# Altium project PCB_Project.PrjPcb
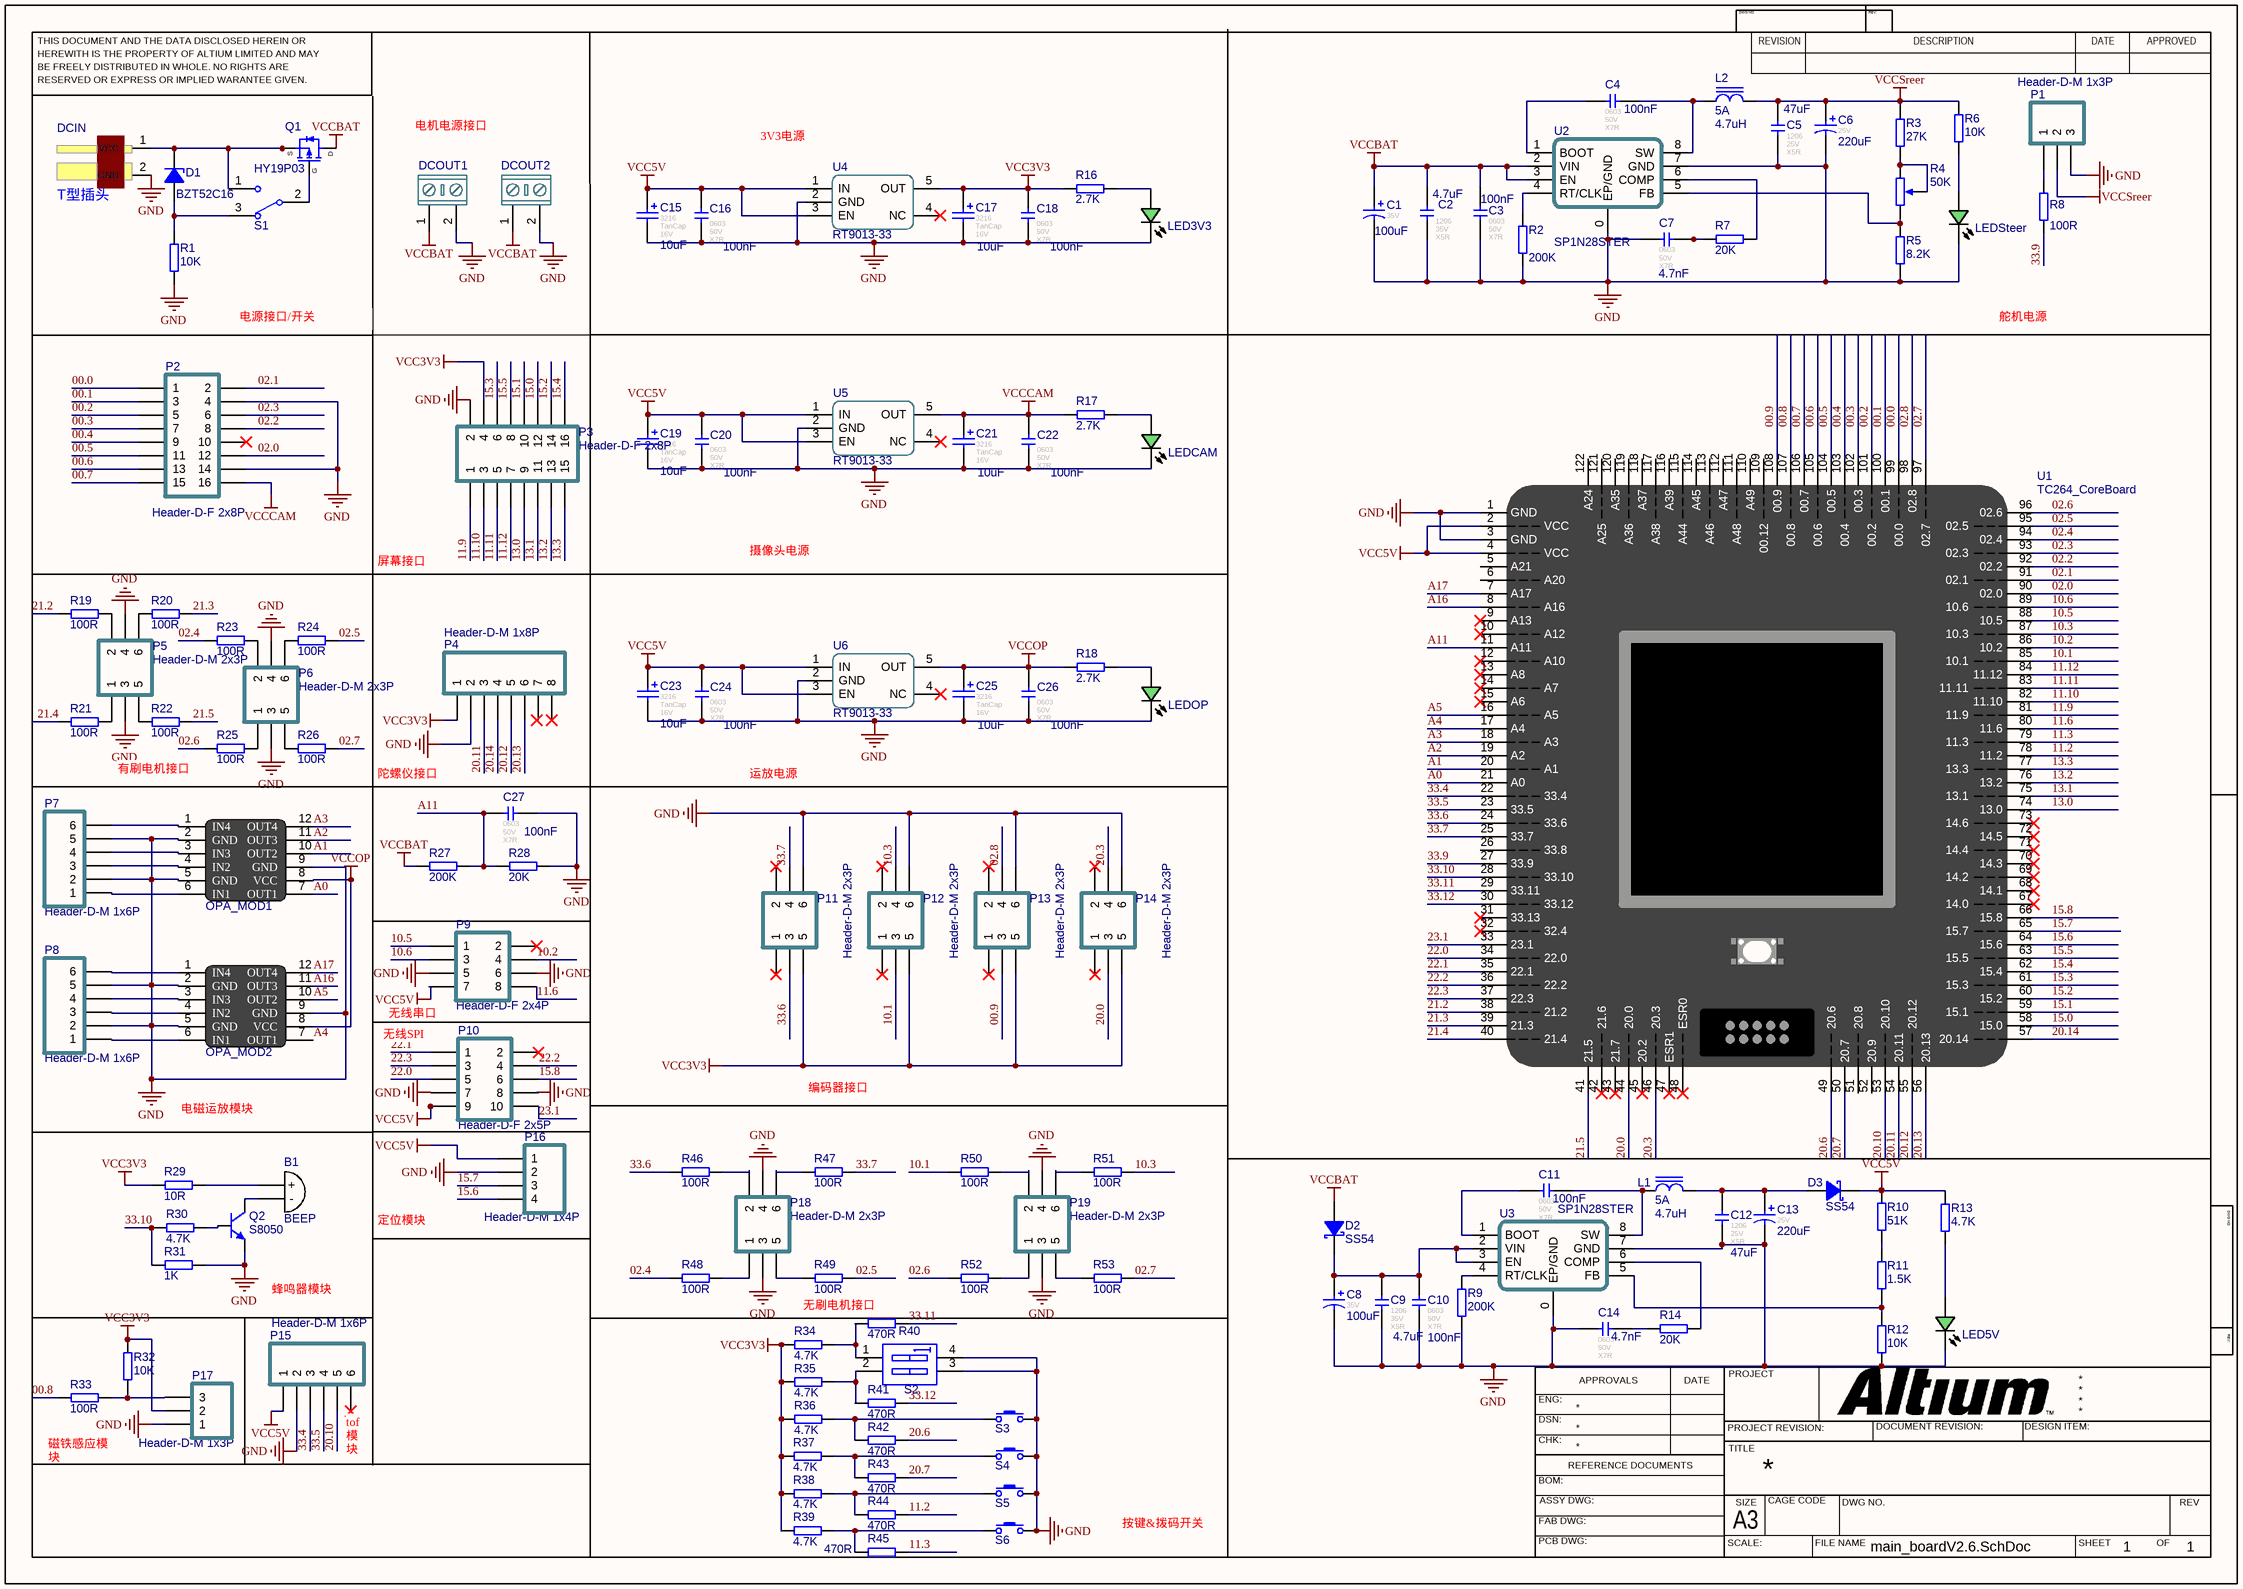
[diagram p0: main_boardV2.6.SchDoc]
1 sheet, 128 parts. Net scope: global (net labels, ports and power ports of the same name join across sheets).
Board file: PCB1.PcbDoc

## Sheet main_boardV2.6.SchDoc
size 420 x 297 mm; SheetNumber: 1; SheetTotal: 1

### Parts
B1  BEEP  [BEEP 9x5.5mm]
C1  value 100uF  Voltage: 35V  [CAP-E-S 6.3]  (hidden comment: 100uF 35V 铝电解)
C2  value 4.7uF  FootPrint: 1206  Voltage: 35V  Type: X5R  [CAPC3216[1206]S]  (hidden comment: 4.7uF 35V X5R)
C3  value 100nF  FootPrint: 0603  Voltage: 50V  Type: X7R  [CAPC1608[0603]S-N]  (hidden comment: 100nF 50V X7R)
C4  value 100nF  FootPrint: 0603  Voltage: 50V  Type: X7R  [CAPC1608[0603]S-N]  (hidden comment: 100nF 50V X7R)
C5  value 47uF  FootPrint: 1206  Voltage: 25V  Type: X5R  [CAPC3216[1206]S]  (hidden comment: 47uF 25V X5R)
C6  value 220uF  Voltage: 25V  [CAP-E-S 6.3]  (hidden comment: 220uF 25V 铝电解)
C7  value 4.7nF  FootPrint: 0603  Voltage: 50V  Type: X7R  [CAPC1608[0603]S-N]  (hidden comment: 4.7nF 50V X7R)
C8  value 100uF  Voltage: 35V  [CAP-E-S 6.3]  (hidden comment: 100uF 35V 铝电解)
C9  value 4.7uF  FootPrint: 1206  Voltage: 35V  Type: X5R  [CAPC3216[1206]S]  (hidden comment: 4.7uF 35V X5R)
C10  value 100nF  FootPrint: 0603  Voltage: 50V  Type: X7R  [CAPC1608[0603]S-N]  (hidden comment: 100nF 50V X7R)
C11  value 100nF  FootPrint: 0603  Voltage: 50V  Type: X7R  [CAPC1608[0603]S-N]  (hidden comment: 100nF 50V X7R)
C12  value 47uF  FootPrint: 1206  Voltage: 25V  Type: X5R  [CAPC3216[1206]S]  (hidden comment: 47uF 25V X5R)
C13  value 220uF  Voltage: 25V  [CAP-E-S 6.3]  (hidden comment: 220uF 25V 铝电解)
C14  value 4.7nF  FootPrint: 0603  Voltage: 50V  Type: X7R  [CAPC1608[0603]S-N]  (hidden comment: 4.7nF 50V X7R)
C15  value 10uF  FootPrint: 3216  Type: TanCap  Voltage: 16V  [CAP-T-S 3216]  (hidden comment: 10uF 16V 钽电容)
C16  value 100nF  FootPrint: 0603  Voltage: 50V  Type: X7R  [CAPC1608[0603]S-N]  (hidden comment: 100nF 50V X7R)
C17  value 10uF  FootPrint: 3216  Type: TanCap  Voltage: 16V  [CAP-T-S 3216]  (hidden comment: 10uF 16V 钽电容)
C18  value 100nF  FootPrint: 0603  Voltage: 50V  Type: X7R  [CAPC1608[0603]S-N]  (hidden comment: 100nF 50V X7R)
C19  value 10uF  FootPrint: 3216  Type: TanCap  Voltage: 16V  [CAP-T-S 3216]  (hidden comment: 10uF 16V 钽电容)
C20  value 100nF  FootPrint: 0603  Voltage: 50V  Type: X7R  [CAPC1608[0603]S-N]  (hidden comment: 100nF 50V X7R)
C21  value 10uF  FootPrint: 3216  Type: TanCap  Voltage: 16V  [CAP-T-S 3216]  (hidden comment: 10uF 16V 钽电容)
C22  value 100nF  FootPrint: 0603  Voltage: 50V  Type: X7R  [CAPC1608[0603]S-N]  (hidden comment: 100nF 50V X7R)
C23  value 10uF  FootPrint: 3216  Type: TanCap  Voltage: 16V  [CAP-T-S 3216]  (hidden comment: 10uF 16V 钽电容)
C24  value 100nF  FootPrint: 0603  Voltage: 50V  Type: X7R  [CAPC1608[0603]S-N]  (hidden comment: 100nF 50V X7R)
C25  value 10uF  FootPrint: 3216  Type: TanCap  Voltage: 16V  [CAP-T-S 3216]  (hidden comment: 10uF 16V 钽电容)
C26  value 100nF  FootPrint: 0603  Voltage: 50V  Type: X7R  [CAPC1608[0603]S-N]  (hidden comment: 100nF 50V X7R)
C27  value 100nF  FootPrint: 0603  Voltage: 50V  Type: X7R  [CAPC1608[0603]S-N]  (hidden comment: 100nF 50V X7R)
D1  BZT52C16  [SOD-123-L]
D2  SS54  [SMA-L[DO-214AC]]
D3  SS54  [SMA-L[DO-214AC]]
DCIN  T型插头  [Wired T-Header ThroughHole]
DCOUT1  KF/WJ/DG 30x connecter  [KF/WJ/DG 301-2p-5.0mm]  (value not drawn)
DCOUT2  KF/WJ/DG 30x connecter  [KF/WJ/DG 301-2p-5.0mm]  (value not drawn)
L1  value 4.7uH  Imax: 5A  [0630 TPC 7*7*3]  (hidden comment: 4.7uH 5A)
L2  value 4.7uH  Imax: 5A  [0630 TPC 7*7*3]  (hidden comment: 4.7uH 5A)
LED3V3  翠绿贴片LED  [LEDC1608(0603)-L]  (value not drawn)
LED5V  翠绿贴片LED  [LEDC1608(0603)-L]  (value not drawn)
LEDCAM  翠绿贴片LED  [LEDC1608(0603)-L]  (value not drawn)
LEDOP  翠绿贴片LED  [LEDC1608(0603)-L]  (value not drawn)
LEDSteer  翠绿贴片LED  [LEDC1608(0603)-L]  (value not drawn)
OPA_MOD1  OPA_MOD  [SEEKFREE_4CHANEL_OPAMOD]  (value not drawn)
OPA_MOD2  OPA_MOD  [SEEKFREE_4CHANEL_OPAMOD]  (value not drawn)
P1  Header-D-M 1x3P  [HDR1X3-M]
P2  Header-D-F 2x8P  [HDR2X8-F]
P3  Header-D-F 2x8P  [HDR2X8-F]
P4  Header-D-M 1x8P  [HDR1X8-M]
P5  Header-D-M 2x3P  [HDR2X3-M]
P6  Header-D-M 2x3P  [HDR2X3-M]
P7  Header-D-M 1x6P  [HDR1X6-M]
P8  Header-D-M 1x6P  [HDR1X6-M]
P9  Header-D-F 2x4P  [HDR2X4-F]
P10  Header-D-F 2x5P  [HDR2X5-F]
P11  Header-D-M 2x3P  [HDR2X3-M]
P12  Header-D-M 2x3P  [HDR2X3-M]
P13  Header-D-M 2x3P  [HDR2X3-M]
P14  Header-D-M 2x3P  [HDR2X3-M]
P15  Header-D-M 1x6P  [HDR1X6-M]
P16  Header-D-M 1x4P  [HDR1X4-M]
P17  Header-D-M 1x3P  [HDR1X3-M]
P18  Header-D-M 2x3P  [HDR2X3-M]
P19  Header-D-M 2x3P  [HDR2X3-M]
Q1  HY19P03  [TO-252AA]
Q2  S8050  [SOT-23]
R1  value 10K  [RESC1608[0603]S-N]  (hidden comment: 10K ±1%)
R2  value 200K  [RESC1608[0603]S-N]  (hidden comment: 200K ±1%)
R3  value 27K  [RESC1608[0603]S-N]  (hidden comment: 27K ±1%)
R4  50K  [RESPOT3296W]
R5  value 8.2K  [RESC1608[0603]S-N]  (hidden comment: 8.2K ±1%)
R6  value 10K  [RESC1608[0603]S-N]  (hidden comment: 10K ±1%)
R7  value 20K  [RESC1608[0603]S-N]  (hidden comment: 20K ±1%)
R8  value 100R  [RESC1608[0603]S-N]  (hidden comment: 100R ±1%)
R9  value 200K  [RESC1608[0603]S-N]  (hidden comment: 200K ±1%)
R10  value 51K  [RESC1608[0603]S-N]  (hidden comment: 51K ±1%)
R11  value 1.5K  [RESC1608[0603]S-N]  (hidden comment: 1.5K ±1%)
R12  value 10K  [RESC1608[0603]S-N]  (hidden comment: 10K ±1%)
R13  value 4.7K  [RESC1608[0603]S-N]  (hidden comment: 4.7K ±1%)
R14  value 20K  [RESC1608[0603]S-N]  (hidden comment: 20K ±1%)
R16  value 2.7K  [RESC1608[0603]S-N]  (hidden comment: 2.7K ±1%)
R17  value 2.7K  [RESC1608[0603]S-N]  (hidden comment: 2.7K ±1%)
R18  value 2.7K  [RESC1608[0603]S-N]  (hidden comment: 2.7K ±1%)
R19  value 100R  [RESC1608[0603]S-N]  (hidden comment: 100R ±1%)
R20  value 100R  [RESC1608[0603]S-N]  (hidden comment: 100R ±1%)
R21  value 100R  [RESC1608[0603]S-N]  (hidden comment: 100R ±1%)
R22  value 100R  [RESC1608[0603]S-N]  (hidden comment: 100R ±1%)
R23  value 100R  [RESC1608[0603]S-N]  (hidden comment: 100R ±1%)
R24  value 100R  [RESC1608[0603]S-N]  (hidden comment: 100R ±1%)
R25  value 100R  [RESC1608[0603]S-N]  (hidden comment: 100R ±1%)
R26  value 100R  [RESC1608[0603]S-N]  (hidden comment: 100R ±1%)
R27  value 200K  [RESC1608[0603]S-N]  (hidden comment: 200K ±1%)
R28  value 20K  [RESC1608[0603]S-N]  (hidden comment: 20K ±1%)
R29  value 10R  [RESC1608[0603]S-N]  (hidden comment: 10R ±1%)
R30  value 4.7K  [RESC1608[0603]S-N]  (hidden comment: 4.7K ±1%)
R31  value 1K  [RESC1608[0603]S-N]  (hidden comment: 1K ±1%)
R32  value 10K  [RESC1608[0603]S-N]  (hidden comment: 10K ±1%)
R33  value 100R  [RESC1608[0603]S-N]  (hidden comment: 100R ±1%)
R34  value 4.7K  [RESC1608[0603]S-N]  (hidden comment: 4.7K ±1%)
R35  value 4.7K  [RESC1608[0603]S-N]  (hidden comment: 4.7K ±1%)
R36  value 4.7K  [RESC1608[0603]S-N]  (hidden comment: 4.7K ±1%)
R37  value 4.7K  [RESC1608[0603]S-N]  (hidden comment: 4.7K ±1%)
R38  value 4.7K  [RESC1608[0603]S-N]  (hidden comment: 4.7K ±1%)
R39  value 4.7K  [RESC1608[0603]S-N]  (hidden comment: 4.7K ±1%)
R40  value 470R  [RESC1608[0603]S-N]  (hidden comment: 470R ±1%)
R41  value 470R  [RESC1608[0603]S-N]  (hidden comment: 470R ±1%)
R42  value 470R  [RESC1608[0603]S-N]  (hidden comment: 470R ±1%)
R43  value 470R  [RESC1608[0603]S-N]  (hidden comment: 470R ±1%)
R44  value 470R  [RESC1608[0603]S-N]  (hidden comment: 470R ±1%)
R45  value 470R  [RESC1608[0603]S-N]  (hidden comment: 470R ±1%)
R46  value 100R  [RESC1608[0603]S-N]  (hidden comment: 100R ±1%)
R47  value 100R  [RESC1608[0603]S-N]  (hidden comment: 100R ±1%)
R48  value 100R  [RESC1608[0603]S-N]  (hidden comment: 100R ±1%)
R49  value 100R  [RESC1608[0603]S-N]  (hidden comment: 100R ±1%)
R50  value 100R  [RESC1608[0603]S-N]  (hidden comment: 100R ±1%)
R51  value 100R  [RESC1608[0603]S-N]  (hidden comment: 100R ±1%)
R52  value 100R  [RESC1608[0603]S-N]  (hidden comment: 100R ±1%)
R53  value 100R  [RESC1608[0603]S-N]  (hidden comment: 100R ±1%)
S1  SW-SPDT  [SS12D10]  (value not drawn)
S2  SW DIP-2  [Code SW-2-DIP-2.54]  (value not drawn)
S3  Button  [PTS810-3*4-CurvePin]  (value not drawn)
S4  Button  [PTS810-3*4-CurvePin]  (value not drawn)
S5  Button  [PTS810-3*4-CurvePin]  (value not drawn)
S6  Button  [PTS810-3*4-CurvePin]  (value not drawn)
U1  TC264_CoreBoard  [TC264_CoreBoard]
U2  SP1N28STER  [SOP-8E]
U3  SP1N28STER  [SOP-8E]
U4  RT9013-33  [SOT-23-5]
U5  RT9013-33  [SOT-23-5]
U6  RT9013-33  [SOT-23-5]

### Nets
GND: C1.2 C2.1 C3.1 C5.2 C6.2 C7.1 C8.2 C9.1 C10.2 C12.1 C13.2 C14.1 C15.2 C16.1 C17.2 C18.1 C19.2 C20.1 C21.2 C22.1 C23.2 C24.1 C25.2 C26.1 C27.2 DCIN.2(GND) DCOUT1.2 DCOUT2.2 LED3V3.C LED5V.C LEDCAM.C LEDOP.C LEDSteer.C OPA_MOD1.2(GND) OPA_MOD1.5(GND) OPA_MOD1.9(GND) OPA_MOD2.2(GND) OPA_MOD2.5(GND) OPA_MOD2.9(GND) P1.3 P2.4 P2.14 P3.2 P4.2 P5.3 P5.4 P6.3 P6.4 P7.2 P7.5 P8.2 P8.5 P9.5 P9.6 P10.8 P11.6 P12.6 P13.6 P14.6 P15.2 P16.2 P17.1 P18.3 P18.4 P19.3 P19.4 Q2.2(E) R1.1 R2.1 R5.2 R9.1 R12.1 R28.2 R31.2 S2.3(B2) S2.4(B1) S3.1 S4.1 S5.1 S6.1 U1.1(GND) U1.3(GND) U2.0(EP/GND) U2.7(GND) U3.0(EP/GND) U3.7(GND) U4.2(GND) U5.2(GND) U6.2(GND)
VCC3V3: C17.1 C18.2 P3.4 P4.1 P11.5 P12.5 P13.5 P14.5 P17.2 R16.1 R29.1 R32.2 R34.1 R35.1 R36.1 R37.1 R38.1 R39.1 U4.5(OUT)
VCC5V: C15.1 C16.2 C19.1 C20.2 C23.1 C24.2 D3.K P9.7 P10.9 P15.1 P16.1 R10.2 R13.2 U1.2(VCC) U1.4(VCC) U4.1(IN) U4.3(EN) U5.1(IN) U5.3(EN) U6.1(IN) U6.3(EN)
VCCBAT: C1.1 C2.2 C3.2 D2.A DCOUT1.1 DCOUT2.1 Q1.1(D) R27.1 U2.2(VIN) U2.3(EN)
VCCCAM: C21.1 C22.2 P2.16 R17.1 U5.5(OUT)
VCCOP: C25.1 C26.2 OPA_MOD1.8(VCC) OPA_MOD2.8(VCC) R18.1 U6.5(OUT)
VCCSreer: C5.1 C6.1 L2.2 P1.2 R3.2 R6.2
00.0: P2.1 U1.99(00.0)
00.1: P2.3 U1.100(00.1)
00.2: P2.5 U1.101(00.2)
00.3: P2.7 U1.102(00.3)
00.4: P2.9 U1.103(00.4)
00.5: P2.11 U1.104(00.5)
00.6: P2.13 U1.105(00.6)
00.7: P2.15 U1.106(00.7)
00.8: R33.1 U1.107(00.8)
00.9: P13.3 U1.108(00.9)
02.0: P2.12 U1.90(02.0)
02.1: P2.2 U1.91(02.1)
02.2: P2.8 U1.92(02.2)
02.3: P2.6 U1.93(02.3)
02.4: R23.1 R48.1 U1.94(02.4)
02.5: R24.2 R49.2 U1.95(02.5)
02.6: R25.1 R52.1 U1.96(02.6)
02.7: R26.2 R53.2 U1.97(02.7)
02.8: P13.4 U1.98(02.8)
10.1: P12.3 R50.1 U1.85(10.1)
10.2: P9.4 U1.86(10.2)
10.3: P12.4 R51.2 U1.87(10.3)
10.5: P9.1 U1.88(10.5)
10.6: P9.3 U1.89(10.6)
11.2: R44.2 U1.78(11.2)
11.3: R45.2 U1.79(11.3)
11.6: P9.8 U1.80(11.6)
11.9: P3.1 U1.81(11.9)
11.10: P3.3 U1.82(11.10)
11.11: P3.5 U1.83(11.11)
11.12: P3.7 U1.84(11.12)
13.0: P3.9 U1.74(13.0)
13.1: P3.11 U1.75(13.1)
13.2: P3.13 U1.76(13.2)
13.3: P3.15 U1.77(13.3)
15.0: P3.12 U1.58(15.0)
15.1: P3.10 U1.59(15.1)
15.2: P3.14 U1.60(15.2)
15.3: P3.6 U1.61(15.3)
15.4: P3.16 U1.62(15.4)
15.5: P3.8 U1.63(15.5)
15.6: P16.4 U1.64(15.6)
15.7: P16.3 U1.65(15.7)
15.8: P10.6 U1.66(15.8)
20.0: P14.3 U1.44(20.0)
20.3: P14.4 U1.46(20.3)
20.6: R42.2 U1.49(20.6)
20.7: R43.2 U1.50(20.7)
20.10: P15.5 U1.53(20.10)
20.11: P4.3 U1.54(20.11)
20.12: P4.5 U1.55(20.12)
20.13: P4.6 U1.56(20.13)
20.14: P4.4 U1.57(20.14)
21.2: R19.1 U1.38(21.2)
21.3: R20.2 U1.39(21.3)
21.4: R21.1 U1.40(21.4)
21.5: R22.2 U1.41(21.5)
22.0: P10.5 U1.34(22.0)
22.1: P10.1 U1.35(22.1)
22.2: P10.4 U1.36(22.2)
22.3: P10.3 U1.37(22.3)
23.1: P10.10 U1.33(23.1)
33.4: P15.3 U1.22(33.4)
33.5: P15.4 U1.23(33.5)
33.6: P11.3 R46.1 U1.24(33.6)
33.7: P11.4 R47.2 U1.25(33.7)
33.9: R8.1 U1.27(33.9)
33.10: R30.1 R31.1 U1.28(33.10)
33.11: R40.2 U1.29(33.11)
33.12: R41.2 U1.30(33.12)
A0: OPA_MOD1.7(OUT1) U1.21(A0)
A1: OPA_MOD1.10(OUT2) U1.20(A1)
A2: OPA_MOD1.11(OUT3) U1.19(A2)
A3: OPA_MOD1.12(OUT4) U1.18(A3)
A4: OPA_MOD2.7(OUT1) U1.17(A4)
A5: OPA_MOD2.10(OUT2) U1.16(A5)
A11: C27.1 R27.2 R28.1 U1.11(A11)
A16: OPA_MOD2.11(OUT3) U1.8(A16)
A17: OPA_MOD2.12(OUT4) U1.7(A17)
NetB1_1: B1.1(+) R29.2
NetB1_2: B1.2(-) Q2.3(C)
NetC4_1: C4.1 U2.1(BOOT)
NetC4_2: C4.2 L2.1 U2.8(SW)
NetC7_2: C7.2 R7.1
NetC8_1: C8.1 C9.2 C10.1 D2.K U3.2(VIN) U3.3(EN)
NetC11_1: C11.1 U3.1(BOOT)
NetC11_2: C11.2 L1.1 U3.8(SW)
NetC12_2: C12.2 C13.1 D3.A L1.2
NetC14_2: C14.2 R14.1
NetD1_A: D1.A R1.2 S1.3
NetD1_K: D1.K DCIN.1(VCC) Q1.3(S) S1.1
NetLED3V3_A: LED3V3.A R16.2
NetLED5V_A: LED5V.A R13.1
NetLEDCAM_A: LEDCAM.A R17.2
NetLEDOP_A: LEDOP.A R18.2
NetLEDSteer_A: LEDSteer.A R6.1
NetOPA_MOD1_1: OPA_MOD1.1(IN4) P7.6
NetOPA_MOD1_3: OPA_MOD1.3(IN3) P7.4
NetOPA_MOD1_4: OPA_MOD1.4(IN2) P7.3
NetOPA_MOD1_6: OPA_MOD1.6(IN1) P7.1
NetOPA_MOD2_1: OPA_MOD2.1(IN4) P8.6
NetOPA_MOD2_3: OPA_MOD2.3(IN3) P8.4
NetOPA_MOD2_4: OPA_MOD2.4(IN2) P8.3
NetOPA_MOD2_6: OPA_MOD2.6(IN1) P8.1
NetP1_1: P1.1 R8.2
NetP5_1: P5.1 R21.2
NetP5_2: P5.2 R19.2
NetP5_5: P5.5 R22.1
NetP5_6: P5.6 R20.1
NetP6_1: P6.1 R25.2
NetP6_2: P6.2 R23.2
NetP6_5: P6.5 R26.1
NetP6_6: P6.6 R24.1
NetP17_3: P17.3 R32.1 R33.2
NetP18_1: P18.1 R48.2
NetP18_2: P18.2 R46.2
NetP18_5: P18.5 R49.1
NetP18_6: P18.6 R47.1
NetP19_1: P19.1 R52.2
NetP19_2: P19.2 R50.2
NetP19_5: P19.5 R53.1
NetP19_6: P19.6 R51.1
NetQ1_2: Q1.2(G) S1.2
NetQ2_1: Q2.1(B) R30.2
NetR2_2: R2.2 U2.4(RT/CLK)
NetR3_1: R3.1 R4.2(BOT) R4.ADJ
NetR4_1: R4.1(TOP) R5.1 U2.5(FB)
NetR7_2: R7.2 U2.6(COMP)
NetR9_2: R9.2 U3.4(RT/CLK)
NetR10_1: R10.1 R11.2
NetR11_1: R11.1 R12.2 U3.5(FB)
NetR14_2: R14.2 U3.6(COMP)
NetR34_2: R34.2 R40.1 S2.1(A1)
NetR35_2: R35.2 R41.1 S2.2(A2)
NetR36_2: R36.2 R42.1 S3.2
NetR37_2: R37.2 R43.1 S4.2
NetR38_2: R38.2 R44.1 S5.2
NetR39_2: R39.2 R45.1 S6.2

Not connected (* = marked no-connect by the designer): P2 10*; P4 7 8*; P9 2*; P10 2* 7; P11 1* 2*; P12 1* 2*; P13 1* 2*; P14 1* 2*; P15 6*; U1 5(A21) 6(A20) 9(A13)* 10(A12)* 12(A10)* 13(A8)* 14(A7)* 15(A6)* 26(33.8) 31(33.13)* 32(32.4)* 42(21.6)* 43(21.7)* 45(20.2)* 47(ESR1)* 48(ESR0)* 51(20.8) 52(20.9) 67(14.0)* 68(14.1)* 69(14.2)* 70(14.3)* 71(14.4)* 72(14.5)* 73(14.6)* 109(00.12) 110(A49) 111(A48) 112(A47) 113(A46) 114(A45) 115(A44) 116(A39) 117(A38) 118(A37) 119(A36) 120(A35) 121(A25) 122(A24); U4 4(NC)*; U5 4(NC)*; U6 4(NC)*

### Notes on the sheet
- 电机电源接口
- (near U4) 3V3电源
- 电源接口/开关
- 舵机电源
- 屏幕接口
- 摄像头电源
- (near R25) 有刷电机接口
- 陀螺仪接口
- 运放电源
- (near P10) 无线SPI
- (near P9) 无线串口
- 电磁运放模块
- 编码器接口
- 定位模块
- (near Q2) 蜂鸣器模块
- 无刷电机接口
- 磁铁感应模块
- (near P15) tof模块
- 按键&拨码开关
- Labels drawn without touching a wire or pin: GND
- THIS DOCUMENT AND THE DATA DISCLOSED HEREIN OR
- HEREWITH IS THE PROPERTY OF ALTIUM LIMITED AND MAY
- DWG NO:
- REVISION
- REV:
- DESCRIPTION
- DATE
- APPROVED
- BE FREELY DISTRIBUTED IN WHOLE. NO RIGHTS ARE
- RESERVED OR EXPRESS OR IMPLIED WARANTEE GIVEN.
- ENG:
- APPROVALS
- PROJECT
- DSN:
- CHK:
- REFERENCE DOCUMENTS
- PROJECT REVISION:
- TITLE
- DOCUMENT REVISION:
- DESIGN ITEM:
- BOM:
- FAB DWG:
- PCB DWG:
- ASSY DWG:
- SCALE:
- A3
- SIZE
- CAGE CODE
- FILE NAME
- DWG NO.
- SHEET
- OF
- REV

### Library data of the parts
B1 = BEEP: 蜂鸣器
C1 C8 = E-S 100uF 35V 6.3x7.7: 贴片电解电容 100uF 35V 6.3x7.7; Revision: V1.0; Type: 铝电解
C2 C9 = 4.7uF 1206 35V X5R: 贴片瓷片电容; MLCC; 1206(3216);; Revision: V1.0
C3 C4 C10 C11 C16 C18 C20 C22 C24 C26 C27 = 100nF 0603 50V X7R: 贴片瓷片电容; MLCC; 0603(1608);; Revision: V1.0
C5 C12 = 47uF 1206 25V X5R: 贴片瓷片电容; MLCC; 1206(3216);; Revision: V1.0
C6 C13 = E-S 220uF 25V 6.3x7.7: 贴片电解电容 220uF 25V 6.3x7.7; Revision: V1.0; Type: 铝电解
C7 C14 = 4.7nF 0603 50V X7R: 贴片瓷片电容; MLCC; 0603(1608);; Revision: V1.0
C15 C17 C19 C21 C23 C25 = T-S 10uF 3216 16V: 贴片钽电容 10uF 3216 16V; Revision: July-2002: Re-released for DXP Platform.
D1 = Diode Zen: 稳压二极管 齐纳二极管  Zener Diode; Published: 8-Jun-2000; Revision: July-2002: Re-released for DXP Platform.; Publisher: Altium Limited; Price(RMB): 0.000
D2 D3 = SS54: SS54 肖特基二极管; Revision: V1.0; Value: SS54
DCIN = T_Header
DCOUT1 DCOUT2 = KF/WJ/DG 30x: 接线端子 2Pin
L1 L2 = Ind-Power: 功率电感; DCR: .5m; Published: 8-Jun-2000; Revision: July-2002: Re-released for DXP Platform.; Publisher: Altium Limited; Price(RMB): 0.000
LED3V3 LED5V LEDCAM LEDOP LEDSteer = LED Chip Green: Published: 8-Jun-2000; Revision: July-2002: Re-released for DXP Platform.; Publisher: Altium Limited; Price(RMB): 0.00
OPA_MOD1 OPA_MOD2 = OPA_4CHANNEL_SEEKFREE: 逐飞科技 运放模块
P1 P17 = Header-D-M 1x3P: 1x3pin, 直插, 排针; Revision: V1.0; Value: Header-D-M 1x3P
P2 P3 = Header-D-F 2x8P: 2x8pin, 直插, 双排座; Revision: V1.0; Value: Header-D-F 2x8P
P4 = Header-D-M 1x8P: 1x8pin, 直插, 排针; Revision: V1.0; Value: Header-D-M 1x8P
P5 P6 P11-P14 P18 P19 = Header-D-M 2x3P: 2x3pin, 直插, 双排针; Revision: V1.0; Value: Header-D-M 2x3P
P7 P8 P15 = Header-D-M 1x6P: 1x6pin, 直插, 排针; Revision: V1.0; Value: Header-D-M 1x6P
P9 = Header-D-F 2x4P: 2x4pin, 直插, 双排座; Revision: V1.0; Value: Header-D-F 2x4P
P10 = Header-D-F 2x5P: 2x5pin, 直插, 双排座; Revision: V1.0; Value: Header-D-F 2x5P
P16 = Header-D-M 1x4P: 1x4pin, 直插, 排针; Revision: V1.0; Value: Header-D-M 1x4P
Q1 = HY19P03: HY19P03 P-Channel MOSFET
Q2 = NPN S8050: NPN 三极管; Published: 8-Jun-2000; Revision: July-2002: Re-released for DXP Platform.; Publisher: Altium Limited; Price(RMB): 0.000; PartNumber: S8050
R1 R6 R12 R32 = Res-Chip: 贴片电阻; Power: 1/8W; Revision: V1.0; Tolerance: ±1%
R2 R9 R27 = Res-Chip_1: 贴片电阻; Power: 1/8W; Revision: V1.0; Tolerance: ±1%
R3 = Res-Chip_7: 贴片电阻; Power: 1/8W; Revision: V1.0; Tolerance: ±1%
R4 = Res-Adj-3p: 可调电阻; Revision: V1.0; Value: 50K
R5 = Res-Chip_8: 贴片电阻; Power: 1/8W; Revision: V1.0; Tolerance: ±1%
R7 R14 R28 = Res-Chip_4: 贴片电阻; Power: 1/8W; Revision: V1.0; Tolerance: ±1%
R8 R19-R26 R33 R46-R53 = Res-Chip_9: 贴片电阻; Power: 1/8W; Revision: V1.0; Tolerance: ±1%
R10 = Res-Chip_2: 贴片电阻; Power: 1/8W; Revision: V1.0; Tolerance: ±1%
R11 = Res-Chip_5: 贴片电阻; Power: 1/8W; Revision: V1.0; Tolerance: ±1%
R13 R30 R34-R39 = Res-Chip_3: 贴片电阻; Power: 1/8W; Revision: V1.0; Tolerance: ±1%
R16-R18 = Res-Chip_6: 贴片电阻; Power: 1/8W; Revision: V1.0; Tolerance: ±1%
R29 = Res-Chip_10: 贴片电阻; Power: 1/8W; Revision: V1.0; Tolerance: ±1%
R31 = Res-Chip_11: 贴片电阻; Power: 1/8W; Revision: V1.0; Tolerance: ±1%
R40-R45 = Res-Chip_12: 贴片电阻; Power: 1/8W; Revision: V1.0; Tolerance: ±1%
S1 = SW-SPDT: 单刀双掷开关 3脚船型、钮子、拨动开关 SPDT Subminiature Toggle Switch; Published: 24-Mar-1999; Publisher: Altium Limited; Price(RMB): 0.000
S2 = Code SW-2: 2位拨码开关; Published: 24-Mar-1999; Revision: July-2002: Re-released for DXP Platform.; Publisher: Altium Limited; Price(RMB): 0.000
S3-S6 = KEY: 按键; Published: 24-Mar-1999; Publisher: Altium Limited; Price(RMB): 0.000
U1 = TC264_CoreBoard: 逐飞科技TC264核心板
U4-U6 = RT9013-33: 3.3V 500mA SOT-23-5 LDO
U2 U3 = SP1N28STER: Revision: V1.0; Value: SP1N28STER